# EAGLE schematic PCBAv (EAGLE 9.6.2)
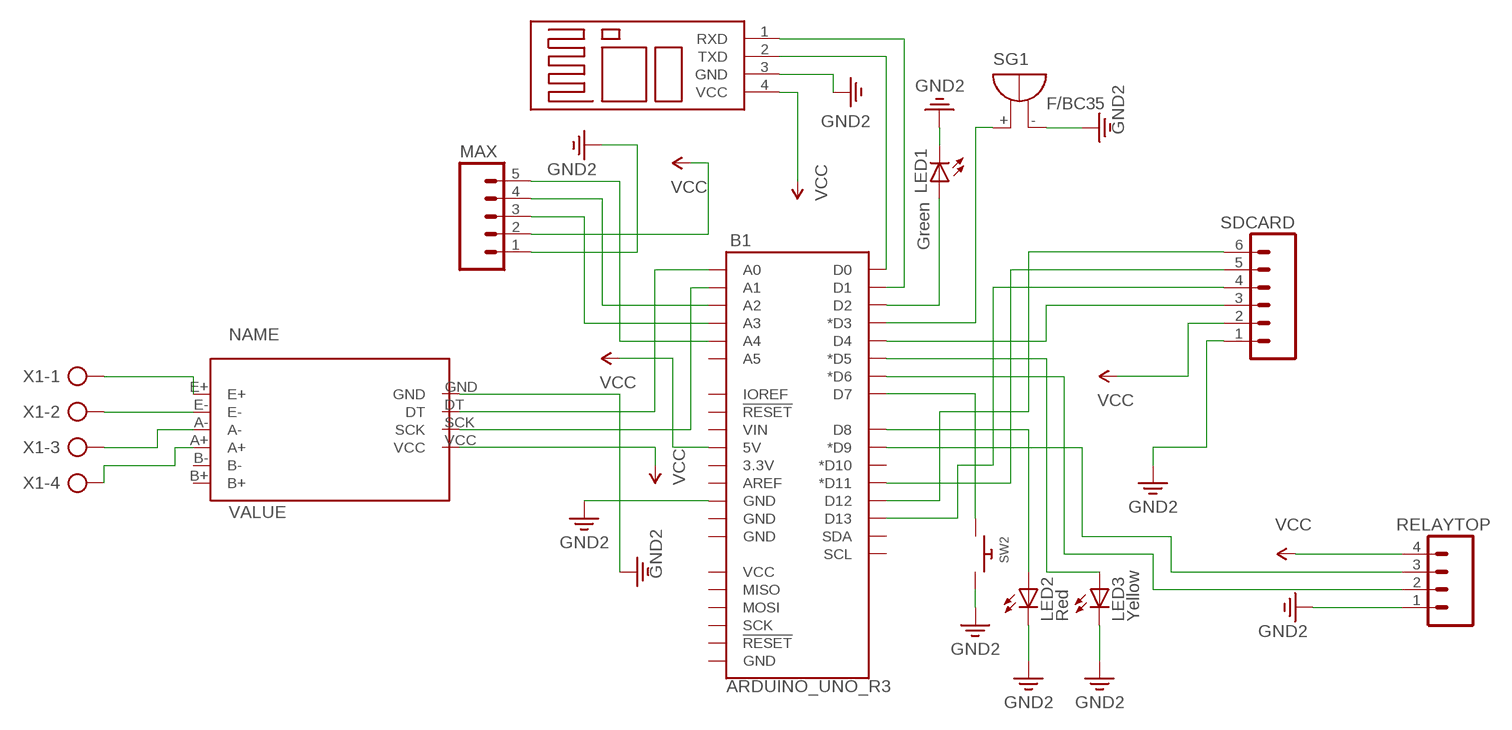
[diagram p0: schematic, sheet 1]

## Parts
B1  ARDUINO_UNO_R3  [ARDUINO_R3]
HC05  BLUETOOTH  [BLUETOOTH]
LED1  Green  LED5MM  [LED5MM]
LED2  Red  LED5MM  [LED5MM]
LED3  Yellow  LED5MM  [LED5MM]
MAX  M05  [05P]
RELAYTOP  M04  [04P]
SDCARD  M06  [06P]
SG1  F/BC35  [F/BC35]
SW2  SWITCH_PUSHBUTTONEVQ-PE  [TACT_PANA-EVQ]
U$1  HX711  [HX711]
X1  AK300/4  [AK300/4]

## Nets
3.3V: B1.GND@4(GND) HC05.3(GND) LED1.K(C) LED2.K(C) LED3.K(C) MAX.1 RELAYTOP.1 SDCARD.1 SG1.- SW2.P$2 U$1.GND ; supply symbol labelled GND2
N$1: B1.D1 HC05.1(RXD)
N$2: B1.A0 U$1.DT
N$3: B1.D0 HC05.2(TXD)
N$4: B1.D7 SW2.P$1
N$5: U$1.E+ X1.1
N$6: U$1.E- X1.2
N$7: U$1.A- X1.3
N$8: U$1.A+ X1.4
N$9: B1.A4 MAX.5
N$10: B1.A2 MAX.4
N$11: B1.A3 MAX.3
N$12: B1.D4 SDCARD.3
N$13: B1.D11(*D11) SDCARD.5
N$14: B1.D13 SDCARD.4
N$15: B1.D12 SDCARD.6
N$17: B1.D8 LED2.A
N$18: B1.D2 LED1.A
N$19: B1.D5(*D5) LED3.A
N$20: B1.D3(*D3) SG1.+
N$21: B1.D9(*D9) RELAYTOP.3
N$23: B1.D6(*D6) RELAYTOP.2
N$24: B1.A1 U$1.SCK
VCC: B1.5V HC05.4(VCC) MAX.2 RELAYTOP.4 SDCARD.2 U$1.VCC
Unconnected: B1.3.3V B1.A5 B1.AREF B1.D10(*D10) B1.GND@1(GND) B1.GND@2(GND) B1.GND@3(GND) B1.IOREF B1.MISO B1.MOSI B1.RESET@1(!RESET!) B1.RESET@2(!RESET!) B1.SCK B1.SCL B1.SDA B1.VCC B1.VIN U$1.B+ U$1.B-

## Library data of the parts
B1 = SparkFun-Boards:ARDUINO_UNO_R3: Arduino R3 Footprint with SPI header Arduino Uno R3 Compatible Footprint. Matches PCB size of the original board. SparkFun Products: SAMD21 Dev Breakout <https://www.sparkfun.com/products/13672> RedBoard <https://www.sparkfun.com/products/12757> R3 Stackable Headers <https://www.sparkfun.com/products/11417>
HC05 = Bluetooth:BLUETOOTH
LED1-LED3 = adafruit:LED: LED OSRAM: - CHIPLED LG R971, LG N971, LY N971, LG Q971, LY Q971, LO R971, LY R971 LH N974, LH R974 LS Q976, LO Q976, LY Q976 LO Q996 - Hyper CHIPLED LW Q18S LB Q993, LB Q99A, LB R99A - SideLED LS A670, LO A670, LY A670, LG A670, LP A670 LB A673, LV A673, LT A673, LW A673 LH A674 LY A675 LS A676, LA A676, LO A676, LY A676, LW A676 LS A679, LY A679, LG A679 - Hyper Micro SIDELED® LS Y876, LA Y876, LO Y876, LY Y876 LT Y87S - SmartLED LW L88C, LW L88S LB L89C, LB L89S, LG L890 LS L89K, LO L89K, LY L89K LS L896, LA L896, LO L896, LY L896 - TOPLED LS T670, LO T670, LY T670, LG T670, LP T670 LSG T670, LSP T670, LSY T670, LOP T670, LYG T670 LG T671, LOG T671, LSG T671 LB T673, LV T673, LT T673, LW T673 LH T674 LS T676, LA T676, LO T676, LY T676, LB T676, LH T676, LSB T676, LW T676 LB T67C, LV T67C, LT T67C, LS T67K, LO T67K, LY T67K, LW E67C LS E67B, LA E67B, LO E67B, LY E67B, LB E67C, LV E67C, LT E67C LW T67C LS T679, LY T679, LG T679 LS T770, LO T770, LY T770, LG T770, LP T770 LB T773, LV T773, LT T773, LW T773 LH T774 LS E675, LA E675, LY E675, LS T675 LS T776, LA T776, LO T776, LY T776, LB T776 LHGB T686 LT T68C, LB T68C - Hyper Mini TOPLED® LB M676 - Mini TOPLED Santana® LG M470 LS M47K, LO M47K, LY M47K Source: http://www.osram.convergy.de/
MAX = con-amp-quick:M05: AMP QUICK CONNECTOR; OC_FARNELL: unknown; OC_NEWARK: unknown
RELAYTOP = con-amp-quick:M04: AMP QUICK CONNECTOR; OC_FARNELL: unknown; OC_NEWARK: unknown
SDCARD = con-amp-quick:M06: AMP QUICK CONNECTOR; OC_FARNELL: unknown; OC_NEWARK: unknown
SG1 = buzzer:F/BC35: BUZZER Source: Spoerle; OC_FARNELL: unknown; OC_NEWARK: unknown
SW2 = adafruit:SWITCH_PUSHBUTTON: Buttons SOFTTOUCHSMD_SJ - Soft touch temporary push button (Super Junk Akihabara) Compatible with SKPMANE010 [Mouser: 688-SKPMAN] C&K_KSS = Digikey: KSS221GLFS
U$1 = HX711:HX711
X1 = con-ptr500:AK300/4: CONNECTOR; OC_FARNELL: unknown; OC_NEWARK: unknown